# Altium project Mainboard.PrjPcb (part 3 of 3)

## Sheet USB_Connectors.SchDoc
size A3; PageSetup: Record=PageOptions|CenterHorizontal=True|CenterVertical=True|PrintScale=0.71|XCorrection=1.00|YCorrection=1.00|PrintKind=0|BorderSize=5000000|LeftOffset=0|BottomOffset=0|Orientation=2|PaperLength=1000|PaperWidth=1000|Scale=100|PaperSource=7|PrintQuality=-4|MediaType=1|DitherType=10|PaperKind=A4|PrintScaleMode=1; Date: 27.05.2014; DrawnBy: luths8; Organization: BFH; Address1: Bern University of Applied Sciences; Address2: Engineering and Information Technology; Address3: Jlcoweg 1; Address4: CH-3400 Burgdorf; DocumentNumber: 7; Revision: 1.0; SheetNumber: 10; SheetTotal: 19; CurrentDate: 27.05.2014
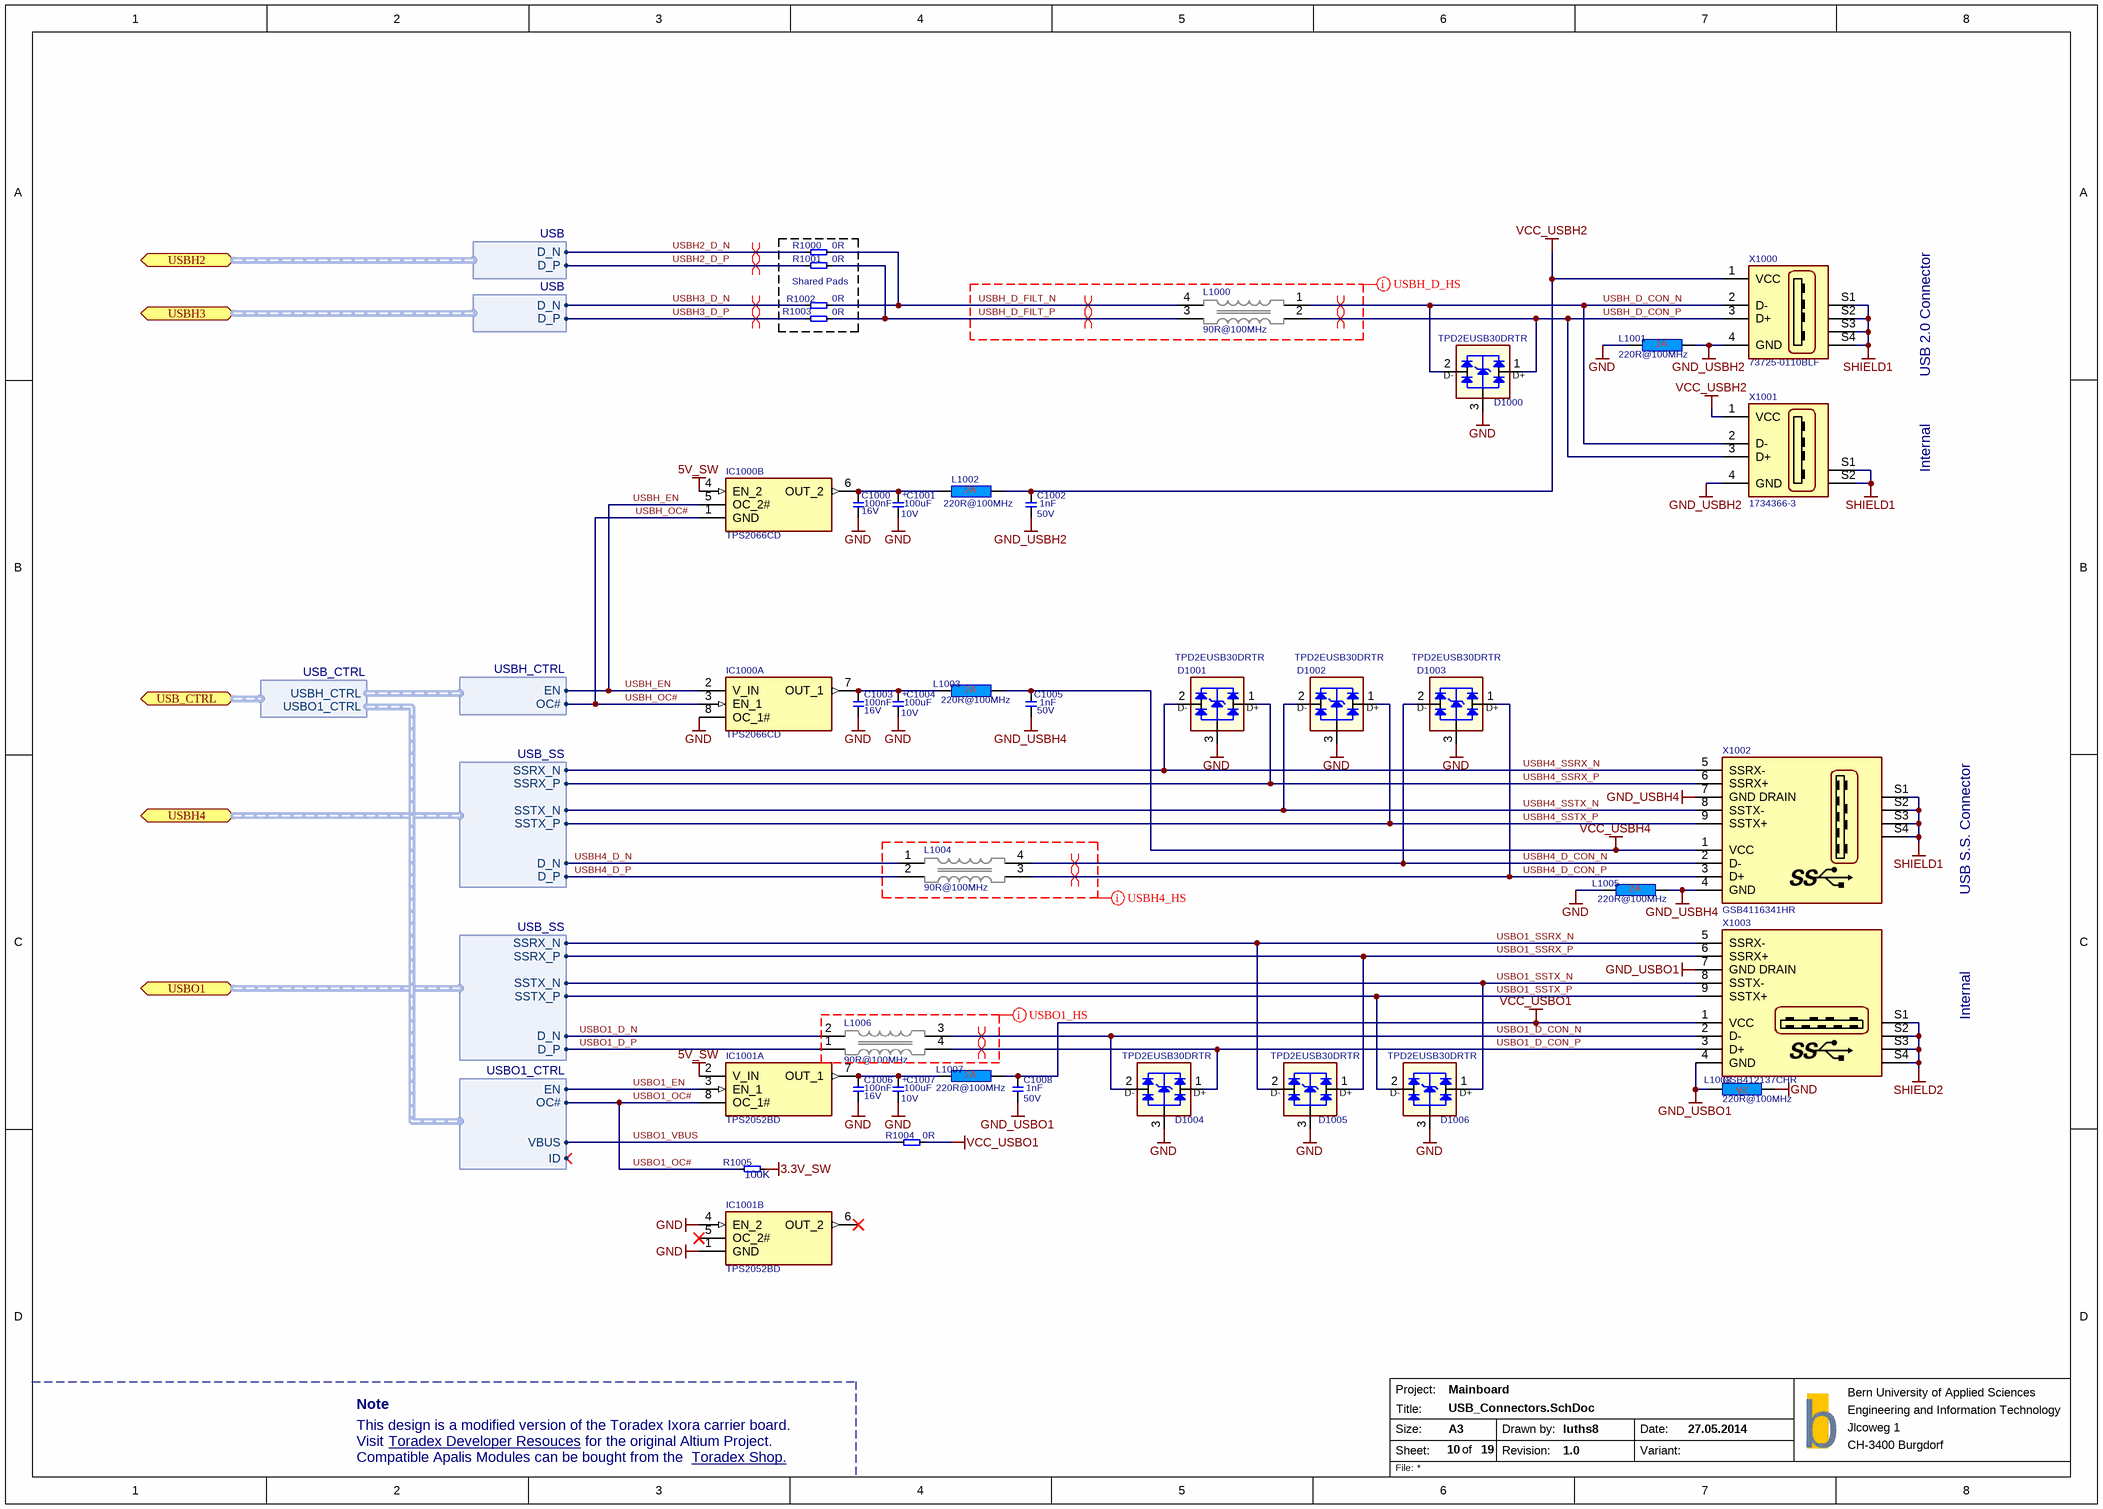
[diagram p14: USB_Connectors.SchDoc]

### Parts
C1000  Rating: 16V  [SMD0603CAP]  (hidden comment: 100nF)
C1001  Rating: 10V  [CAPMP6032X280N]  (hidden comment: 100uF)
C1002  Rating: 50V  [SMD0603CAP]  (hidden comment: 1nF)
C1003  Rating: 16V  [SMD0603CAP]  (hidden comment: 100nF)
C1004  Rating: 10V  [CAPMP6032X280N]  (hidden comment: 100uF)
C1005  Rating: 50V  [SMD0603CAP]  (hidden comment: 1nF)
C1006  Rating: 16V  [SMD0603CAP]  (hidden comment: 100nF)
C1007  Rating: 10V  [CAPMP6032X280N]  (hidden comment: 100uF)
C1008  Rating: 50V  [SMD0603CAP]  (hidden comment: 1nF)
D1000  TPD2EUSB30DRTR  [T_TI_TPD2EUSB30DRTR]
D1001  TPD2EUSB30DRTR  [T_TI_TPD2EUSB30DRTR]
D1002  TPD2EUSB30DRTR  [T_TI_TPD2EUSB30DRTR]
D1003  TPD2EUSB30DRTR  [T_TI_TPD2EUSB30DRTR]
D1004  TPD2EUSB30DRTR  [T_TI_TPD2EUSB30DRTR]
D1005  TPD2EUSB30DRTR  [T_TI_TPD2EUSB30DRTR]
D1006  TPD2EUSB30DRTR  [T_TI_TPD2EUSB30DRTR]
IC1000  TPS2066CD  [SOIC127P600X173-8N]  (parts A,B of 2)
IC1001  TPS2052BD  [SOIC127P600X173-8N]  (parts A,B of 2)
L1000  90R@100MHz  [T_Murata_DLW21SN900SQ2]
L1001  220R@100MHz  [INDC1608X95N]
L1002  220R@100MHz  [INDC1608X95N]
L1003  220R@100MHz  [INDC1608X95N]
L1004  90R@100MHz  [T_Murata_DLW21SN900SQ2]
L1005  220R@100MHz  [INDC1608X95N]
L1006  90R@100MHz  [T_Murata_DLW21SN900SQ2]
L1007  220R@100MHz  [INDC1608X95N]
L1008  220R@100MHz  [INDC1608X95N]
R1000  0R  [SMD0603RES]
R1001  0R  [SMD0603RES]
R1002  0R  [SMD0603RES]
R1003  0R  [SMD0603RES]
R1004  0R  [SMD0603RES]
R1005  100K  [SMD0603RES]
X1000  Manufacturer Part No.: 73725-0110BLF  [T_FCI_73725-0110BLF]  (hidden comment: CON-Fci-73725-0110BLF)
X1001  CON-TE-1734366-3  [1734366-3]  (value not drawn)
X1002  GSB4116341HR  [GSB4116341HR]
X1003  GSB412137CHR  [GSB412137CHR]

### Blocks framed on the sheet
Shared Pads: R1000-R1003

### Ports
USB_CTRL (bidir, harness USB_CTRL), USBH2 (bidir, harness USB), USBH3 (bidir, harness USB), USBH4 (bidir, harness USB_SS), USBO1 (bidir, harness USB_SS)

### Harnesses
USB_SS: D_N, D_P, SSTX_N, SSTX_P, SSRX_N, SSRX_P
USBO1_CTRL: VBUS, ID, OC#, EN
USBH_CTRL: OC#, EN
USB_CTRL: USBO1_CTRL, USBH_CTRL
USB: D_N, D_P

### Nets
3.3V_SW: R1005.2
5V_SW: IC1000.4(EN_2) IC1001.2(V_IN)
GND: C1000.1 C1001.2 C1003.1 C1004.2 C1006.1 C1007.2 D1000.3 D1001.3 D1002.3 D1003.3 D1004.3 D1005.3 D1006.3 IC1000.8(OC_1#) IC1001.1(GND) IC1001.4(EN_2) L1001.1 L1005.1 L1008.1
GND_USBH2: C1002.1 L1001.2 X1000.4(GND) X1001.4(GND)
GND_USBH4: C1005.1 L1005.2 X1002.4(GND) X1002.7(GND_DRAIN)
GND_USBO1: C1008.1 L1008.2 X1003.4(GND) X1003.7(GND_DRAIN)
SHIELD1: X1000.S1 X1000.S2 X1000.S3 X1000.S4 X1001.S1 X1001.S2 X1002.S1 X1002.S2 X1002.S3 X1002.S4
SHIELD2: X1003.S1 X1003.S2 X1003.S3 X1003.S4
VCC_USBH2: C1002.2 L1002.2 X1000.1(VCC) X1001.1(VCC)
VCC_USBH4: C1005.2 L1003.2 X1002.1(VCC)
VCC_USBO1: C1008.2 L1007.2 R1004.2 X1003.1(VCC)
USBH2_D_N: R1000.1 ; port USBH2.D_N
USBH2_D_P: R1001.1 ; port USBH2.D_P
USBH3_D_N: R1002.1 ; port USBH3.D_N
USBH3_D_P: R1003.1 ; port USBH3.D_P
USBH4_D_CON_N: D1003.2(D-) L1004.4 X1002.2(D-)
USBH4_D_CON_P: D1003.1(D+) L1004.3 X1002.3(D+)
USBH4_D_N: L1004.1 ; port USBH4.D_N
USBH4_D_P: L1004.2 ; port USBH4.D_P
USBH4_SSRX_N: D1001.2(D-) X1002.5(SSRX-) ; port USBH4.SSRX_N
USBH4_SSRX_P: D1001.1(D+) X1002.6(SSRX+) ; port USBH4.SSRX_P
USBH4_SSTX_N: D1002.2(D-) X1002.8(SSTX-) ; port USBH4.SSTX_N
USBH4_SSTX_P: D1002.1(D+) X1002.9(SSTX+) ; port USBH4.SSTX_P
USBH_D_CON_N: D1000.2(D-) L1000.1 X1000.2(D-) X1001.2(D-)
USBH_D_CON_P: D1000.1(D+) L1000.2 X1000.3(D+) X1001.3(D+)
USBH_D_FILT_N: L1000.4 R1000.2 R1002.2
USBH_D_FILT_P: L1000.3 R1001.2 R1003.2
USBH_EN: IC1000.2(V_IN) IC1000.5(OC_2#) ; harness USBH_CTRL.EN
USBH_OC#: IC1000.1(GND) IC1000.3(EN_1) ; harness USBH_CTRL.OC#
USBO1_D_CON_N: D1004.2(D-) L1006.3 X1003.2(D-)
USBO1_D_CON_P: D1004.1(D+) L1006.4 X1003.3(D+)
USBO1_D_N: L1006.2 ; port USBO1.D_N
USBO1_D_P: L1006.1 ; port USBO1.D_P
USBO1_EN: IC1001.3(EN_1) ; harness USBO1_CTRL.EN
USBO1_OC#: IC1001.8(OC_1#) R1005.1 ; harness USBO1_CTRL.OC#
USBO1_SSRX_N: D1005.2(D-) X1003.5(SSRX-) ; port USBO1.SSRX_N
USBO1_SSRX_P: D1005.1(D+) X1003.6(SSRX+) ; port USBO1.SSRX_P
USBO1_SSTX_N: D1006.1(D+) X1003.8(SSTX-) ; port USBO1.SSTX_N
USBO1_SSTX_P: D1006.2(D-) X1003.9(SSTX+) ; port USBO1.SSTX_P
USBO1_VBUS: R1004.1 ; harness USBO1_CTRL.VBUS
NetC1000_2: C1000.2 C1001.1 IC1000.6(OUT_2) L1002.1
NetC1003_2: C1003.2 C1004.1 IC1000.7(OUT_1) L1003.1
NetC1006_2: C1006.2 C1007.1 IC1001.7(OUT_1) L1007.1

Not connected (* = marked no-connect by the designer): IC1001 5(OC_2#)* 6(OUT_2)*

### Layout directives
differential pair: USBH2_D_N, USBH2_D_P, USBH3_D_N, USBH3_D_P, USBH4_D_CON_N, USBH4_D_CON_P, USBH_D_CON_N, USBH_D_CON_P, USBH_D_FILT_N, USBH_D_FILT_P, USBO1_D_CON_N, USBO1_D_CON_P
net class USBO1_HS: (no net found under the mark)
net class USBH4_HS: (no net found under the mark)
net class USBH_D_HS: USBH_D_FILT_N, USBH_D_FILT_P

### Notes on the sheet
- USB 2.0 Connector
- Internal
- USB S.S. Connector
- Note
- This design is a modified version of the Toradex Ixora carrier board.
- Visit
- Compatible Apalis Modules can be bought from the
- Toradex Developer Resouces <https://developer.toradex.com/products/ixora-carrier-board>
- for the original Altium Project.
- Toradex Shop. <https://www.toradex.com/order-now/apalis-arm-family>
- Project:
- Size:
- Sheet:
- Title:
- A3
- of
- Drawn by:
- Revision:
- Date:
- Variant:
- b
- File:
- (in symbol C-TA-100uF-10V-10%-6032) +

### Library data of the parts
C1000 C1003 C1006 = C-X7R-100nF-16V-10%-0402: Capacitor Ceramic X7R 100nF 16V 10% 0603; Tolerance: 10%; Type: X7R; Value: 100nF
C1001 C1004 C1007 = C-TA-100uF-10V-10%-6032: Capacitor TA 100uF 10V 10% 6032; Tolerance: 10%; Type: TA; Value: 100uF
C1002 C1005 C1008 = C-X7R-1nF-50V-10%-0402: Capacitor Ceramic X7R 1nF 50V 10% 0603; Tolerance: 10%; Type: X7R; Value: 1nF
D1000-D1006 = D-TI-TPD2EUSB30DRTR: 2 Channel Protection for Super Speed USB3.0; Manufacturer Name: TI; Manufacturer Part No.: TPD2EUSB30DRTR
IC1000 = IC-TI-TPS2066CD: 1A Dual High Side Switch (Current Limiting (Fixed), Over Temperature, Reverse Current, UVLO); Manufacturer Name: Texas Instruments; Manufacturer Part No.: TPS2066CD
IC1001 = IC-TI-TPS2052BD: Dual High Side Switch With OC_DET 500mA/CH; Manufacturer Name: Texas Instruments; Manufacturer Part No.: TPS2052BD
L1000 L1004 L1006 = L-Murata-DLW21SN900SQ2-90R@100MHz-330mA-25%: Common Mode Choke High Speed 90R 330mA; Manufacturer Name: Murata; Tolerance: 25%; Rating: 330mA; Manufacturer Part No.: DLW21SN900SQ2; Value: 90R@100MHz
L1001-L1003 L1005 L1007 L1008 = L-220R@100MHz-2A-25%-0603: 220R@100MHz 2A EMI FILTER; Tolerance: 25%; Rating: 2A; Value: 220R@100MHz
R1000-R1003 = R-0R-63mW-1%-0603: Resistor 0 ohm 63mW 1% 0603; Rating: 63mW; Tolerance: 1%; Value: 0R
R1004 = R-0R-63mW-1%-0402: Resistor 0 ohm 63mW 1% 0603; Rating: 63mW; Tolerance: 1%; Value: 0R
R1005 = R-100KR-63mW-5%-0402: Resistor 100 Kohm 63mW 5% 0603; Value: 100KR; Rating: 63mW; Tolerance: 5%
X1000 = CON-Fci-73725-0110BLF: USB Type A Connector; Manufacturer Name: FCI; No. of ways: 4; System: Connector
X1001 = CON-TE-1734366-3: USB Type A Connector Vertical; Manufacturer Name: TE; Manufacturer Part No.: 1734366-3; System: Connector
X1002 = CON-Amphenol-GSB4116341HR: USB 3.1, Type A, sideways; System: Connector; Manufacturer Name: Amphenol; Manufacturer Part No.: GSB4116341HR
X1003 = CON-Amphenol-GSB412137CHR: USB 3.1, Type A, vertical; System: Connector; Manufacturer Name: Amphenol; Manufacturer Part No.: GSB412137CHR

## Sheet USB.SchDoc
size A3; PageSetup: Record=PageOptions|CenterHorizontal=True|CenterVertical=True|PrintScale=0.73|XCorrection=1.00|YCorrection=1.00|PrintKind=0|BorderSize=5000000|LeftOffset=0|BottomOffset=0|Orientation=2|PaperLength=1000|PaperWidth=1000|Scale=100|PaperSource=7|PrintQuality=-4|MediaType=1|DitherType=10|PaperKind=A4|PrintScaleMode=1; Date: 27.05.2014; DrawnBy: luths8; Organization: BFH; Address1: Bern University of Applied Sciences; Address2: Engineering and Information Technology; Address3: Jlcoweg 1; Address4: CH-3400 Burgdorf; DocumentNumber: 6; Revision: 1.0; SheetNumber: 9; SheetTotal: 19; CurrentDate: 27.05.2014
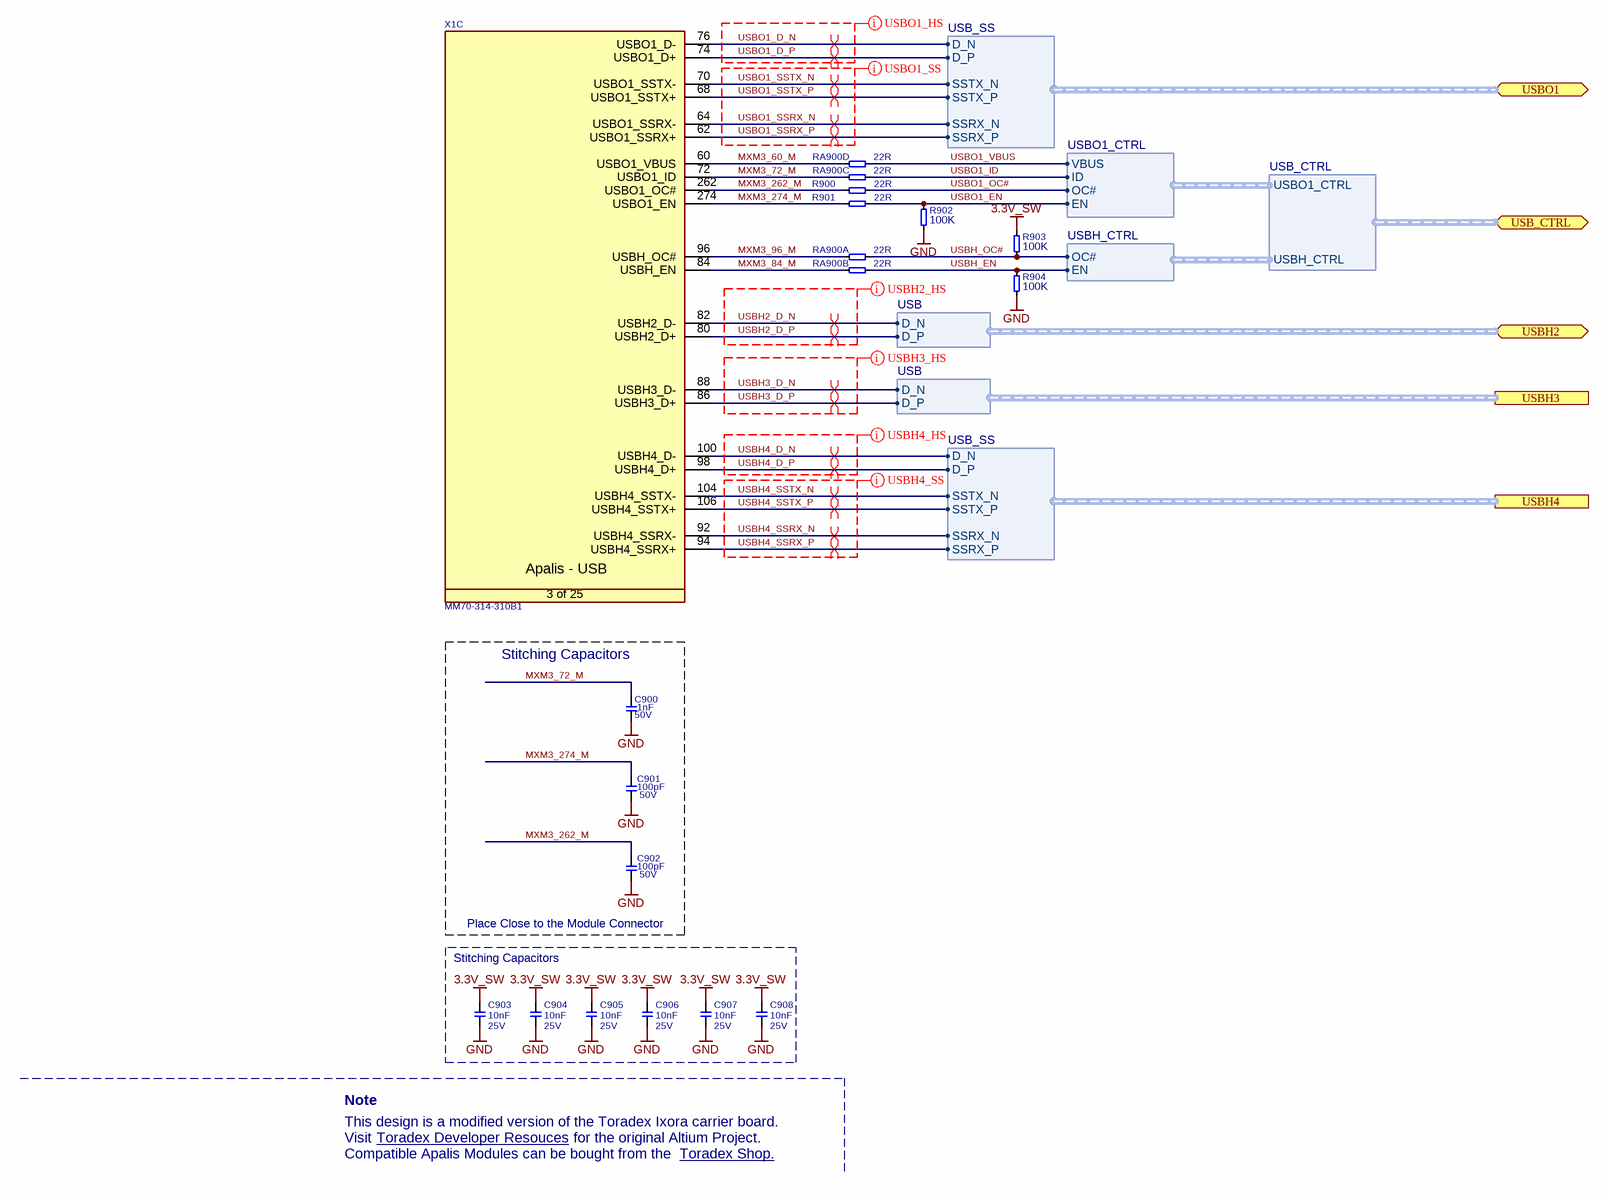
[diagram p15: USB.SchDoc]

### Parts
C900  Rating: 50V  [SMD0603CAP]  (hidden comment: 1nF)
C901  Rating: 50V  [SMD0603CAP]  (hidden comment: 100pF)
C902  Rating: 50V  [SMD0603CAP]  (hidden comment: 100pF)
C903  10nF  Rating: 25V  [SMD0603CAP]
C904  10nF  Rating: 25V  [SMD0603CAP]
C905  10nF  Rating: 25V  [SMD0603CAP]
C906  10nF  Rating: 25V  [SMD0603CAP]
C907  10nF  Rating: 25V  [SMD0603CAP]
C908  10nF  Rating: 25V  [SMD0603CAP]
R900  22R  [SMD0603RES]
R901  22R  [SMD0603RES]
R902  100K  [SMD0603RES]
R903  100K  [SMD0603RES]
R904  100K  [SMD0603RES]
RA900  22R  [T_Resistor_Array_X4]  (parts A,B,C,D of 4)
X1  Manufacturer Part No.: MM70-314-310B1  [T_JAE_MM70-314-310B1]  (hidden comment: CON-JAE-MM70-314-310B1-314-0.5mm)  (part C of 25)

### Blocks framed on the sheet
Stitching Capacitors: C900-C902

### Ports
USB_CTRL (bidir, harness USB_CTRL), USBH2 (bidir, harness USB), USBH3 (harness USB), USBH4 (harness USB_SS), USBO1 (bidir, harness USB_SS)

### Harnesses
USB_SS: D_N, D_P, SSTX_N, SSTX_P, SSRX_N, SSRX_P
USB: D_N, D_P
USBO1_CTRL: VBUS, ID, OC#, EN
USBH_CTRL: OC#, EN
USB_CTRL: USBO1_CTRL, USBH_CTRL

### Nets
3.3V_SW: C903.2 C904.2 C905.2 C906.2 C907.2 C908.2 R903.1
GND: C900.1 C901.1 C902.1 C903.1 C904.1 C905.1 C906.1 C907.1 C908.1 R902.1 R904.1
MXM3_60_M: RA900.1 X1.60(USBO1_VBUS)
MXM3_72_M: C900.2 RA900.2 X1.72(USBO1_ID)
MXM3_84_M: RA900.3 X1.84(USBH_EN)
MXM3_96_M: RA900.4 X1.96(USBH_OC#)
MXM3_262_M: C902.2 R900.1 X1.262(USBO1_OC#)
MXM3_274_M: C901.2 R901.1 X1.274(USBO1_EN)
USBH2_D_N: X1.82(USBH2_D-) ; port USBH2.D_N
USBH2_D_P: X1.80(USBH2_D+) ; port USBH2.D_P
USBH3_D_N: X1.88(USBH3_D-) ; port USBH3.D_N
USBH3_D_P: X1.86(USBH3_D+) ; port USBH3.D_P
USBH4_D_N: X1.100(USBH4_D-) ; port USBH4.D_N
USBH4_D_P: X1.98(USBH4_D+) ; port USBH4.D_P
USBH4_SSRX_N: X1.92(USBH4_SSRX-) ; port USBH4.SSRX_N
USBH4_SSRX_P: X1.94(USBH4_SSRX+) ; port USBH4.SSRX_P
USBH4_SSTX_N: X1.104(USBH4_SSTX-) ; port USBH4.SSTX_N
USBH4_SSTX_P: X1.106(USBH4_SSTX+) ; port USBH4.SSTX_P
USBH_EN: R904.2 RA900.7 ; harness USBH_CTRL.EN
USBH_OC#: R903.2 RA900.8 ; harness USBH_CTRL.OC#
USBO1_D_N: X1.76(USBO1_D-) ; port USBO1.D_N
USBO1_D_P: X1.74(USBO1_D+) ; port USBO1.D_P
USBO1_EN: R901.2 R902.2 ; harness USBO1_CTRL.EN
USBO1_ID: RA900.6 ; harness USBO1_CTRL.ID
USBO1_OC#: R900.2 ; harness USBO1_CTRL.OC#
USBO1_SSRX_N: X1.64(USBO1_SSRX-) ; port USBO1.SSRX_N
USBO1_SSRX_P: X1.62(USBO1_SSRX+) ; port USBO1.SSRX_P
USBO1_SSTX_N: X1.70(USBO1_SSTX-) ; port USBO1.SSTX_N
USBO1_SSTX_P: X1.68(USBO1_SSTX+) ; port USBO1.SSTX_P
USBO1_VBUS: RA900.5 ; harness USBO1_CTRL.VBUS

### Layout directives
differential pair: USBH2_D_N, USBH2_D_P, USBH3_D_N, USBH3_D_P, USBH4_D_N, USBH4_D_P, USBH4_SSRX_N, USBH4_SSRX_P, USBH4_SSTX_N, USBH4_SSTX_P, USBO1_D_N, USBO1_D_P, USBO1_SSRX_N, USBO1_SSRX_P, USBO1_SSTX_N, USBO1_SSTX_P
net class USBO1_SS: USBO1_SSRX_N, USBO1_SSRX_P, USBO1_SSTX_N, USBO1_SSTX_P
net class USBO1_HS: USBO1_D_N, USBO1_D_P
net class USBH2_HS: USBH2_D_N, USBH2_D_P
net class USBH3_HS: USBH3_D_N, USBH3_D_P
net class USBH4_SS: USBH4_SSRX_N, USBH4_SSRX_P, USBH4_SSTX_N, USBH4_SSTX_P
net class USBH4_HS: USBH4_D_N, USBH4_D_P

### Notes on the sheet
- (near C902) Place Close to the Module Connector
- Stitching Capacitors
- Note
- This design is a modified version of the Toradex Ixora carrier board.
- Visit
- Compatible Apalis Modules can be bought from the
- Toradex Developer Resouces <https://developer.toradex.com/products/ixora-carrier-board>
- for the original Altium Project.
- Toradex Shop. <https://www.toradex.com/order-now/apalis-arm-family>
- Project:
- Size:
- Sheet:
- Title:
- A3
- of
- Drawn by:
- Revision:
- Date:
- Variant:
- b
- File:
- (in symbol CON-JAE-MM70-314-310B1-314-0.5mm, part C) Apalis - USB; 3 of 25

### Library data of the parts
C900 = C-X7R-1nF-50V-10%-0402: Capacitor Ceramic X7R 1nF 50V 10% 0603; Tolerance: 10%; Type: X7R; Value: 1nF
C901 C902 = C-X7R-100pF-50V-10%-0402: Capacitor Ceramic X7R 100pF 50V 10% 0603; Tolerance: 10%; Type: X7R; Value: 100pF
C903-C908 = C-X7R-10nF-25V-10%-0603: Capacitor Ceramic X7R 10nF 25V 10% 0603; Tolerance: 10%; Type: X7R; Value: 10nF
R900 R901 = R-22R-63mW-5%-0402: Resistor 22 ohm 63mW 5% 0603; Rating: 63mW; Tolerance: 5%; Value: 22R
R902-R904 = R-100KR-63mW-5%-0402: as R1005 on sheet USB_Connectors; Rating: 63mW; Tolerance: 5%
RA900 = RA-22R-63mW-5%-1206-div: Resistor Array 22 R 63mW 5% 1206; Tolerance: 5%; Power Dissipation: 63mW; Value: 22R
X1 = CON-JAE-MM70-314-310B1-314-0.5mm: as X1 on sheet Power_Switch

## Sheet HDMI.SchDoc
size A3; PageSetup: Record=PageOptions|CenterHorizontal=True|CenterVertical=True|PrintScale=0.73|XCorrection=1.00|YCorrection=1.00|PrintKind=0|BorderSize=5000000|LeftOffset=0|BottomOffset=0|Orientation=2|PaperLength=1000|PaperWidth=1000|Scale=100|PaperSource=7|PrintQuality=-4|MediaType=1|DitherType=10|PaperKind=A4|PrintScaleMode=1; Date: 27.05.2014; DrawnBy: luths8; Organization: BFH; Address1: Bern University of Applied Sciences; Address2: Engineering and Information Technology; Address3: Jlcoweg 1; Address4: CH-3400 Burgdorf; DocumentNumber: 1; Revision: 1.0; SheetNumber: 14; SheetTotal: 19; CurrentDate: 27.05.2014
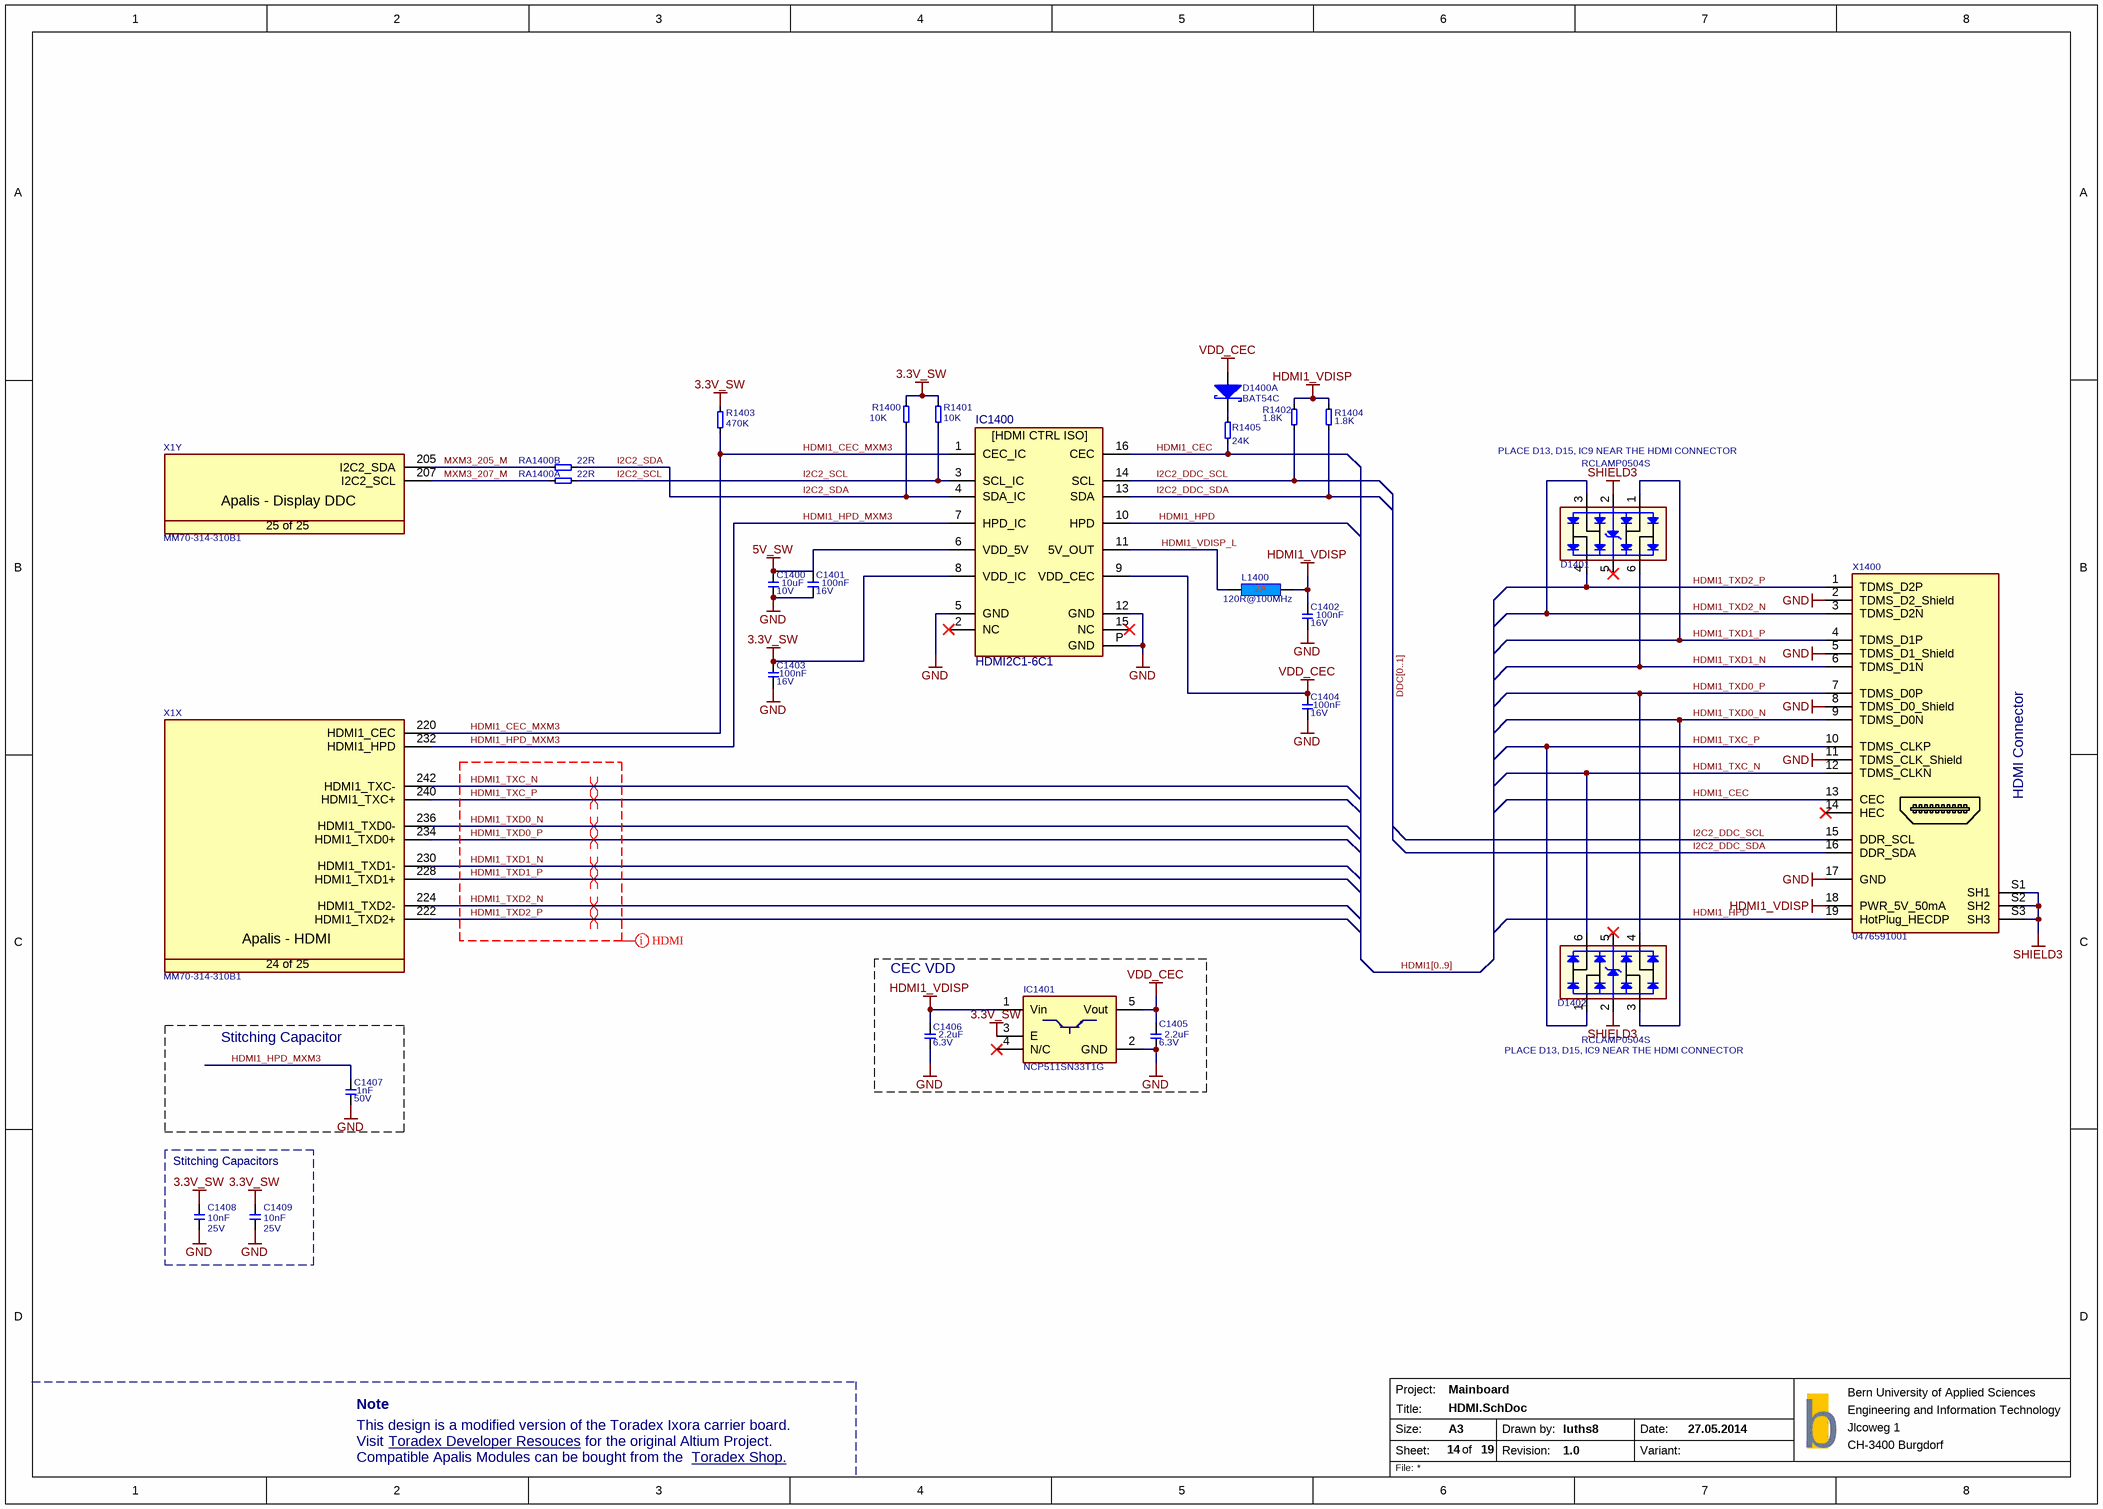
[diagram p16: HDMI.SchDoc]

### Parts
C1400  Rating: 10V  [SMD0603CAP]  (hidden comment: 10uF)
C1401  Rating: 16V  [SMD0603CAP]  (hidden comment: 100nF)
C1402  Rating: 16V  [SMD0603CAP]  (hidden comment: 100nF)
C1403  Rating: 16V  [SMD0603CAP]  (hidden comment: 100nF)
C1404  Rating: 16V  [SMD0603CAP]  (hidden comment: 100nF)
C1405  Rating: 6.3V  [SMD0603CAP]  (hidden comment: 2.2uF)
C1406  Rating: 6.3V  [SMD0603CAP]  (hidden comment: 2.2uF)
C1407  Rating: 50V  [SMD0603CAP]  (hidden comment: 1nF)
C1408  10nF  Rating: 25V  [SMD0603CAP]
C1409  10nF  Rating: 25V  [SMD0603CAP]
D1400  BAT54C  [SOT95P230X110-3N]  (part A of 2)
D1401  RCLAMP0504S  [T_SOT95P285X90-6N]
D1402  RCLAMP0504S  [T_SOT95P285X90-6N]
IC1400  HDMI2C1-6C1  [DFN16]
IC1401  NCP511SN33T1G  [SOT95P279X142-5N]
L1400  120R@100MHz  [INDC1608X95N]
R1400  10K  [SMD0603RES]
R1401  10K  [SMD0603RES]
R1402  1.8K  [SMD0603RES]
R1403  470K  [SMD0603RES]
R1404  1.8K  [SMD0603RES]
R1405  24K  [SMD0603RES]
RA1400  22R  [T_Resistor_Array_X4]  (parts A,B of 4)
X1  Manufacturer Part No.: MM70-314-310B1  [T_JAE_MM70-314-310B1]  (hidden comment: CON-JAE-MM70-314-310B1-314-0.5mm)  (parts X,Y of 25)
X1400  0476591001  [0476591001]

### Blocks framed on the sheet
CEC VDD: C1405 C1406 IC1401
Stitching Capacitor: C1407
Stitching Capacitors: C1408 C1409

### Nets
3.3V_SW: C1403.2 C1408.2 C1409.2 IC1400.8(VDD_IC) IC1401.3(E) R1400.2 R1401.2 R1403.2
5V_SW: C1400.2 C1401.1 IC1400.6(VDD_5V)
GND: C1400.1 C1401.2 C1402.1 C1403.1 C1404.1 C1405.1 C1406.1 C1407.1 C1408.1 C1409.1 IC1400.5(GND) IC1400.12(GND) IC1400.P(GND) IC1401.2(GND) X1400.2(TDMS_D2_Shield) X1400.5(TDMS_D1_Shield) X1400.8(TDMS_D0_Shield) X1400.11(TDMS_CLK_Shield) X1400.17(GND)
HDMI1_VDISP: C1402.2 C1406.2 IC1401.1(Vin) L1400.2 R1402.2 R1404.2 X1400.18(PWR_5V_50mA)
SHIELD3: D1401.2 D1402.2 X1400.S1(SH1) X1400.S2(SH2) X1400.S3(SH3)
VDD_CEC: C1404.2 C1405.2 D1400.1 IC1400.9(VDD_CEC) IC1401.5(Vout)
HDMI1_CEC: IC1400.16(CEC) R1405.1 X1400.13(CEC)
HDMI1_CEC_MXM3: IC1400.1(CEC_IC) R1403.1 X1.220(HDMI1_CEC)
HDMI1_HPD: IC1400.10(HPD) X1400.19(HotPlug_HECDP)
HDMI1_HPD_MXM3: C1407.2 IC1400.7(HPD_IC) X1.232(HDMI1_HPD)
HDMI1_TXC_N: D1402.6 X1.242(HDMI1_TXC-) X1400.12(TDMS_CLKN)
HDMI1_TXC_P: D1402.1 X1.240(HDMI1_TXC+) X1400.10(TDMS_CLKP)
HDMI1_TXD0_N: D1402.3 X1.236(HDMI1_TXD0-) X1400.9(TDMS_D0N)
HDMI1_TXD0_P: D1402.4 X1.234(HDMI1_TXD0+) X1400.7(TDMS_D0P)
HDMI1_TXD1_N: D1401.6 X1.230(HDMI1_TXD1-) X1400.6(TDMS_D1N)
HDMI1_TXD1_P: D1401.1 X1.228(HDMI1_TXD1+) X1400.4(TDMS_D1P)
HDMI1_TXD2_N: D1401.3 X1.224(HDMI1_TXD2-) X1400.3(TDMS_D2N)
HDMI1_TXD2_P: D1401.4 X1.222(HDMI1_TXD2+) X1400.1(TDMS_D2P)
HDMI1_VDISP_L: IC1400.11(5V_OUT) L1400.1
I2C2_DDC_SCL: IC1400.14(SCL) R1402.1 X1400.15(DDR_SCL)
I2C2_DDC_SDA: IC1400.13(SDA) R1404.1 X1400.16(DDR_SDA)
I2C2_SCL: IC1400.3(SCL_IC) R1401.1 RA1400.5
I2C2_SDA: IC1400.4(SDA_IC) R1400.1 RA1400.6
MXM3_205_M: RA1400.2 X1.205(I2C2_SDA)
MXM3_207_M: RA1400.1 X1.207(I2C2_SCL)
NetD1400_3: D1400.3 R1405.2

Not connected (* = marked no-connect by the designer): D1401 5*; D1402 5*; IC1400 2(NC)* 15(NC)*; IC1401 4(N/C)*; X1400 14(HEC)*

### Buses and harness runs
bus DDC[0..1]
bus HDMI1[0..9]

### Layout directives
differential pair: HDMI1_TXC_N, HDMI1_TXC_P, HDMI1_TXD0_N, HDMI1_TXD0_P, HDMI1_TXD1_N, HDMI1_TXD1_P, HDMI1_TXD2_N, HDMI1_TXD2_P
net class HDMI: HDMI1_TXC_N, HDMI1_TXC_P, HDMI1_TXD0_N, HDMI1_TXD0_P, HDMI1_TXD1_N, HDMI1_TXD1_P, HDMI1_TXD2_N, HDMI1_TXD2_P

### Notes on the sheet
- (near D1401) PLACE D13, D15, IC9 NEAR THE HDMI CONNECTOR
- (near X1400) HDMI Connector
- (near D1402) PLACE D13, D15, IC9 NEAR THE HDMI CONNECTOR
- Note
- This design is a modified version of the Toradex Ixora carrier board.
- Visit
- Compatible Apalis Modules can be bought from the
- Toradex Developer Resouces <https://developer.toradex.com/products/ixora-carrier-board>
- for the original Altium Project.
- Toradex Shop. <https://www.toradex.com/order-now/apalis-arm-family>
- Project:
- Size:
- Sheet:
- Title:
- A3
- of
- Drawn by:
- Revision:
- Date:
- Variant:
- b
- File:
- (in symbol CON-JAE-MM70-314-310B1-314-0.5mm, part X) Apalis - HDMI; 24 of 25
- (in symbol CON-JAE-MM70-314-310B1-314-0.5mm, part Y) Apalis - Display DDC; 25 of 25
- (in symbol HDMI2C1-6C1) [HDMI CTRL ISO]

### Library data of the parts
C1400 = C-X5R-10uF-10V-20%-0603: Capacitor Ceramic X5R 10uF 10V 20% 0603; Tolerance: 20%; Type: X5R; Value: 10uF
C1401-C1404 = C-X7R-100nF-16V-10%-0402: Capacitor Ceramic X7R 100nF 16V 10% 0603; Tolerance: 10%; Type: X7R; Value: 100nF
C1405 C1406 = C-X5R-2.2uF-6.3V-20%-0603: Capacitor Ceramic X5R 2.2uF 6.3V 20% 0603; Tolerance: 20%; Type: X5R; Value: 2.2uF
C1407 = C-X7R-1nF-50V-10%-0402: Capacitor Ceramic X7R 1nF 50V 10% 0603; Tolerance: 10%; Type: X7R; Value: 1nF
C1408 C1409 = C-X7R-10nF-25V-10%-0603: Capacitor Ceramic X7R 10nF 25V 10% 0603; Tolerance: 10%; Type: X7R; Value: 10nF
D1400 = D-Philips-BAT54C-Schottky-30V-200mA: BAT54 Schottky Diode; Manufacturer: Philips; Manufacturer Part Number: BAT54C
D1401 D1402 = D-Semtech-RClamp0504S: TVS Array low cap; Manufacturer Name: Semtech; Manufacturer Part No.: RCLAMP0504S
IC1400 = HDMI2C1-6C1: HDMI ESD protection, level shifter and backdrive protection; Manufacturer Name: STMicroelectronics
IC1401 = IC-ON-NCP511SN33T1G: NCP511SN33T1G LDO Regulator; Manufacturer Name: ON Semiconductor; Manufacturer Part No.: NCP511SN33T1G
L1400 = L-120R@100MHz-2A-25%-0603: 120R@100MHz 2A EMI FILTER; Tolerance: 25%; Rating: 2A; Value: 120R@100MHz
R1400 R1401 = R-10KR-63mW-1%-0603: Resistor 10 Kohm 63mW 1% 0603; Value: 10KR; Rating: 63mW; Tolerance: 1%
R1402 R1404 = R-1.8KR-63mW-5%-0603: Resistor 1.8 Kohm 63mW 5% 0603; Value: 1.8KR; Rating: 63mW; Tolerance: 5%
R1403 = R-470KR-63mW-5%-0402: Resistor 470 Kohm 63mW 5% 0603; Value: 470KR; Rating: 63mW; Tolerance: 5%
R1405 = R-24KR-63mW-1%-0402: Resistor 24 Kohm 63mW 1% 0603; Value: 24KR; Rating: 63mW; Tolerance: 1%
RA1400 = RA-22R-63mW-5%-1206-div: Resistor Array 22 R 63mW 5% 1206; Tolerance: 5%; Power Dissipation: 63mW; Value: 22R
X1 = CON-JAE-MM70-314-310B1-314-0.5mm: MXM3 Connector; Manufacturer Name: JAE; No. of ways: 314
X1400 = CON-Molex-0476591001: HDMI Connector Vertical; Manufacturer: Molex; Manufacturer Part No.: 0476591001; System: Connector

## Sheet Miscellaneous.SchDoc
size A3; PageSetup: Record=PageOptions|CenterHorizontal=True|CenterVertical=True|PrintScale=0.71|XCorrection=1.00|YCorrection=1.00|PrintKind=0|BorderSize=5000000|LeftOffset=0|BottomOffset=0|Orientation=2|PaperLength=1000|PaperWidth=1000|Scale=100|PaperSource=7|PrintQuality=-4|MediaType=1|DitherType=10|PaperKind=A4|PrintScaleMode=1; Date: 27.05.2014; DrawnBy: luths8; Organization: BFH; Address1: Bern University of Applied Sciences; Address2: Engineering and Information Technology; Address3: Jlcoweg 1; Address4: CH-3400 Burgdorf; DocumentNumber: 1; Revision: 1.0; CurrentDate: 27.05.2014
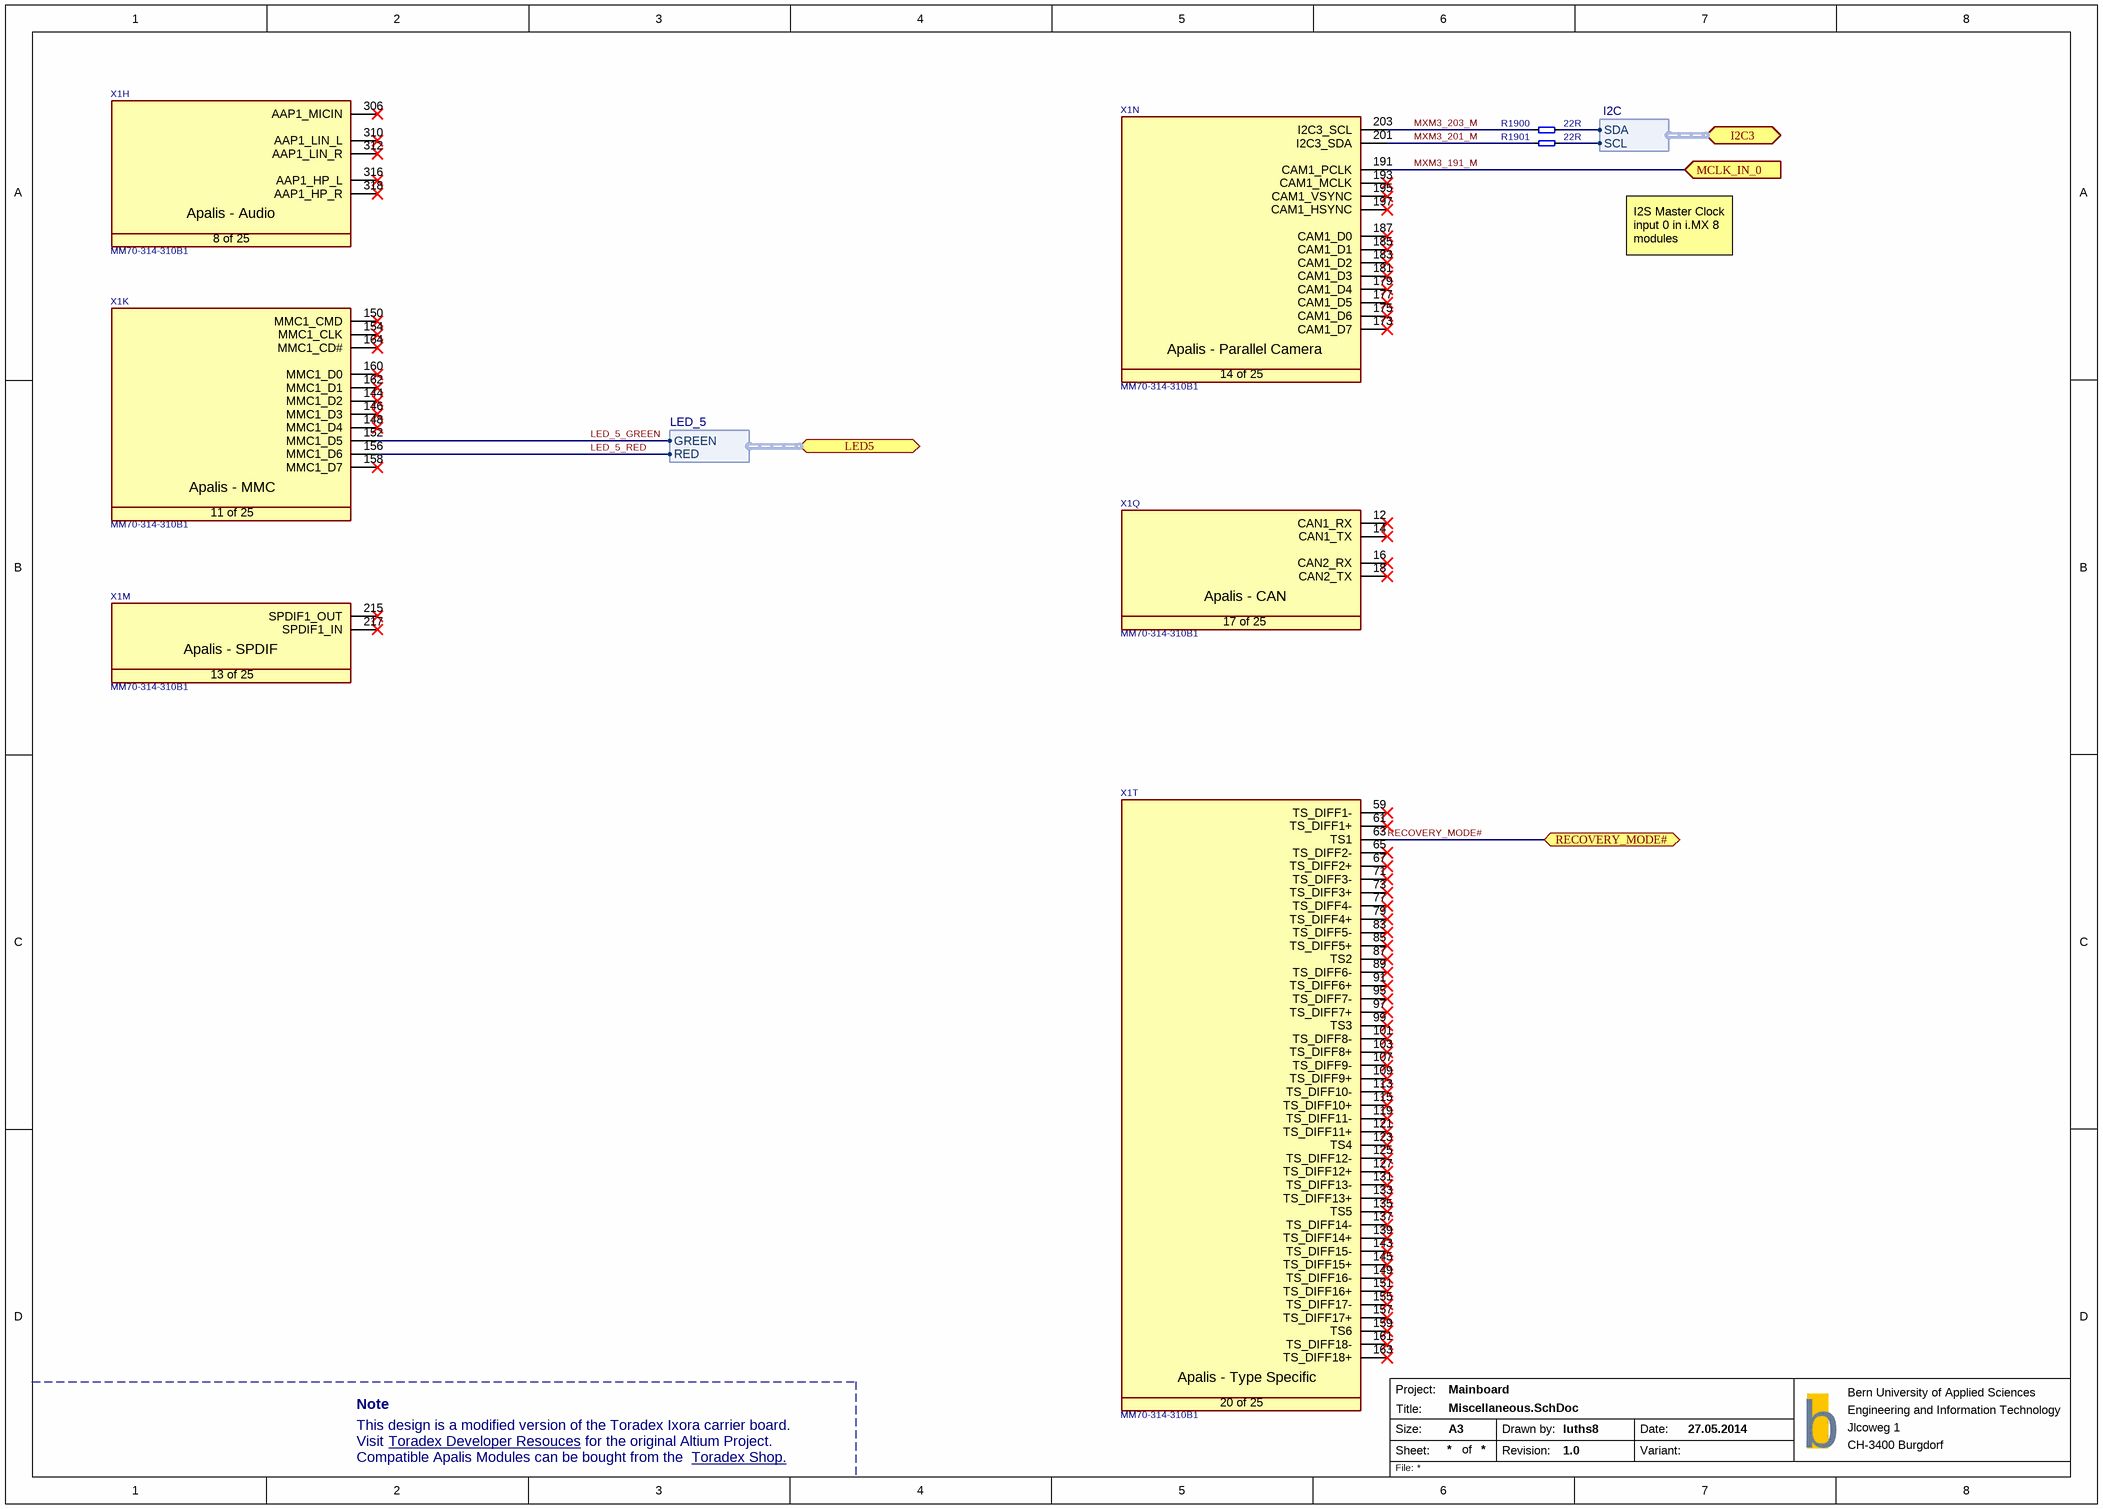
[diagram p17: Miscellaneous.SchDoc]

### Parts
R1900  22R  [SMD0603RES]
R1901  22R  [SMD0603RES]
X1  Manufacturer Part No.: MM70-314-310B1  [T_JAE_MM70-314-310B1]  (hidden comment: CON-JAE-MM70-314-310B1-314-0.5mm)  (parts H,K,M,N,Q,T of 25)

### Ports
I2C3 (bidir, harness I2C, see 12, 17, 19, 5), LED5 (bidir, harness LED_5, see 19), MCLK_IN_0 (in), RECOVERY_MODE# (bidir, see 19)

### Harnesses
LED_5: GREEN, RED
I2C: SCL, SDA

### Nets
LED_5_GREEN: X1.152(MMC1_D5) ; port LED5.GREEN
LED_5_RED: X1.156(MMC1_D6) ; port LED5.RED
MXM3_191_M: X1.191(CAM1_PCLK) ; port MCLK_IN_0
MXM3_201_M: R1901.1 X1.201(I2C3_SDA)
MXM3_203_M: R1900.1 X1.203(I2C3_SCL)
RECOVERY_MODE#: X1.63(TS1) ; port RECOVERY_MODE#
NetR1203_2: R1900.2 ; port I2C3.SDA
NetR1204_2: R1901.2 ; port I2C3.SCL

Not connected (* = marked no-connect by the designer): X1 12(CAN1_RX)* 14(CAN1_TX)* 16(CAN2_RX)* 18(CAN2_TX)* 59(TS_DIFF1-)* 61(TS_DIFF1+)* 65(TS_DIFF2-)* 67(TS_DIFF2+)* 71(TS_DIFF3-)* 73(TS_DIFF3+)* 77(TS_DIFF4-)* 79(TS_DIFF4+)* 83(TS_DIFF5-)* 85(TS_DIFF5+)* 87(TS2)* 89(TS_DIFF6-)* 91(TS_DIFF6+)* 95(TS_DIFF7-)* 97(TS_DIFF7+)* 99(TS3)* 101(TS_DIFF8-)* 103(TS_DIFF8+)* 107(TS_DIFF9-)* 109(TS_DIFF9+)* 113(TS_DIFF10-)* 115(TS_DIFF10+)* 119(TS_DIFF11-)* 121(TS_DIFF11+)* 123(TS4)* 125(TS_DIFF12-)* 127(TS_DIFF12+)* 131(TS_DIFF13-)* 133(TS_DIFF13+)* 135(TS5)* 137(TS_DIFF14-)* 139(TS_DIFF14+)* 143(TS_DIFF15-)* 144(MMC1_D2)* 145(TS_DIFF15+)* 146(MMC1_D3)* 148(MMC1_D4)* 149(TS_DIFF16-)* 150(MMC1_CMD)* 151(TS_DIFF16+)* 154(MMC1_CLK)* 155(TS_DIFF17-)* 157(TS_DIFF17+)* 158(MMC1_D7)* 159(TS6)* 160(MMC1_D0)* 161(TS_DIFF18-)* 162(MMC1_D1)* 163(TS_DIFF18+)* 164(MMC1_CD#)* 173(CAM1_D7)* 175(CAM1_D6)* 177(CAM1_D5)* 179(CAM1_D4)* 181(CAM1_D3)* 183(CAM1_D2)* 185(CAM1_D1)* 187(CAM1_D0)* 193(CAM1_MCLK)* 195(CAM1_VSYNC)* 197(CAM1_HSYNC)* 215(SPDIF1_OUT)* 217(SPDIF1_IN)* 306(AAP1_MICIN)* 310(AAP1_LIN_L)* 312(AAP1_LIN_R)* 316(AAP1_HP_L)* 318(AAP1_HP_R)*

### Notes on the sheet
- I2S Master Clock input 0 in i.MX 8 modules
- Note
- This design is a modified version of the Toradex Ixora carrier board.
- Visit
- Compatible Apalis Modules can be bought from the
- Toradex Developer Resouces <https://developer.toradex.com/products/ixora-carrier-board>
- for the original Altium Project.
- Toradex Shop. <https://www.toradex.com/order-now/apalis-arm-family>
- Project:
- Size:
- Sheet:
- Title:
- A3
- of
- Drawn by:
- Revision:
- Date:
- Variant:
- b
- File:
- (in symbol CON-JAE-MM70-314-310B1-314-0.5mm, part H) Apalis - Audio; 8 of 25
- (in symbol CON-JAE-MM70-314-310B1-314-0.5mm, part K) Apalis - MMC; 11 of 25
- (in symbol CON-JAE-MM70-314-310B1-314-0.5mm, part M) Apalis - SPDIF; 13 of 25
- (in symbol CON-JAE-MM70-314-310B1-314-0.5mm, part N) Apalis - Parallel Camera; 14 of 25
- (in symbol CON-JAE-MM70-314-310B1-314-0.5mm, part Q) Apalis - CAN; 17 of 25
- (in symbol CON-JAE-MM70-314-310B1-314-0.5mm, part T) Apalis - Type Specific; 20 of 25

### Library data of the parts
R1900 R1901 = R-22R-63mW-5%-0402: Resistor 22 ohm 63mW 5% 0603; Rating: 63mW; Tolerance: 5%; Value: 22R
X1 = CON-JAE-MM70-314-310B1-314-0.5mm: as X1 on sheet HDMI

## Sheet Audio.SchDoc
size A3; Date: 27.05.2014; DrawnBy: luths8; Organization: BFH; Address1: Bern University of Applied Sciences; Address2: Engineering and Information Technology; Address3: Jlcoweg 1; Address4: CH-3400 Burgdorf; DocumentNumber: 1; Revision: 1.0; SheetNumber: 12; SheetTotal: 19; CurrentDate: 27.05.2014
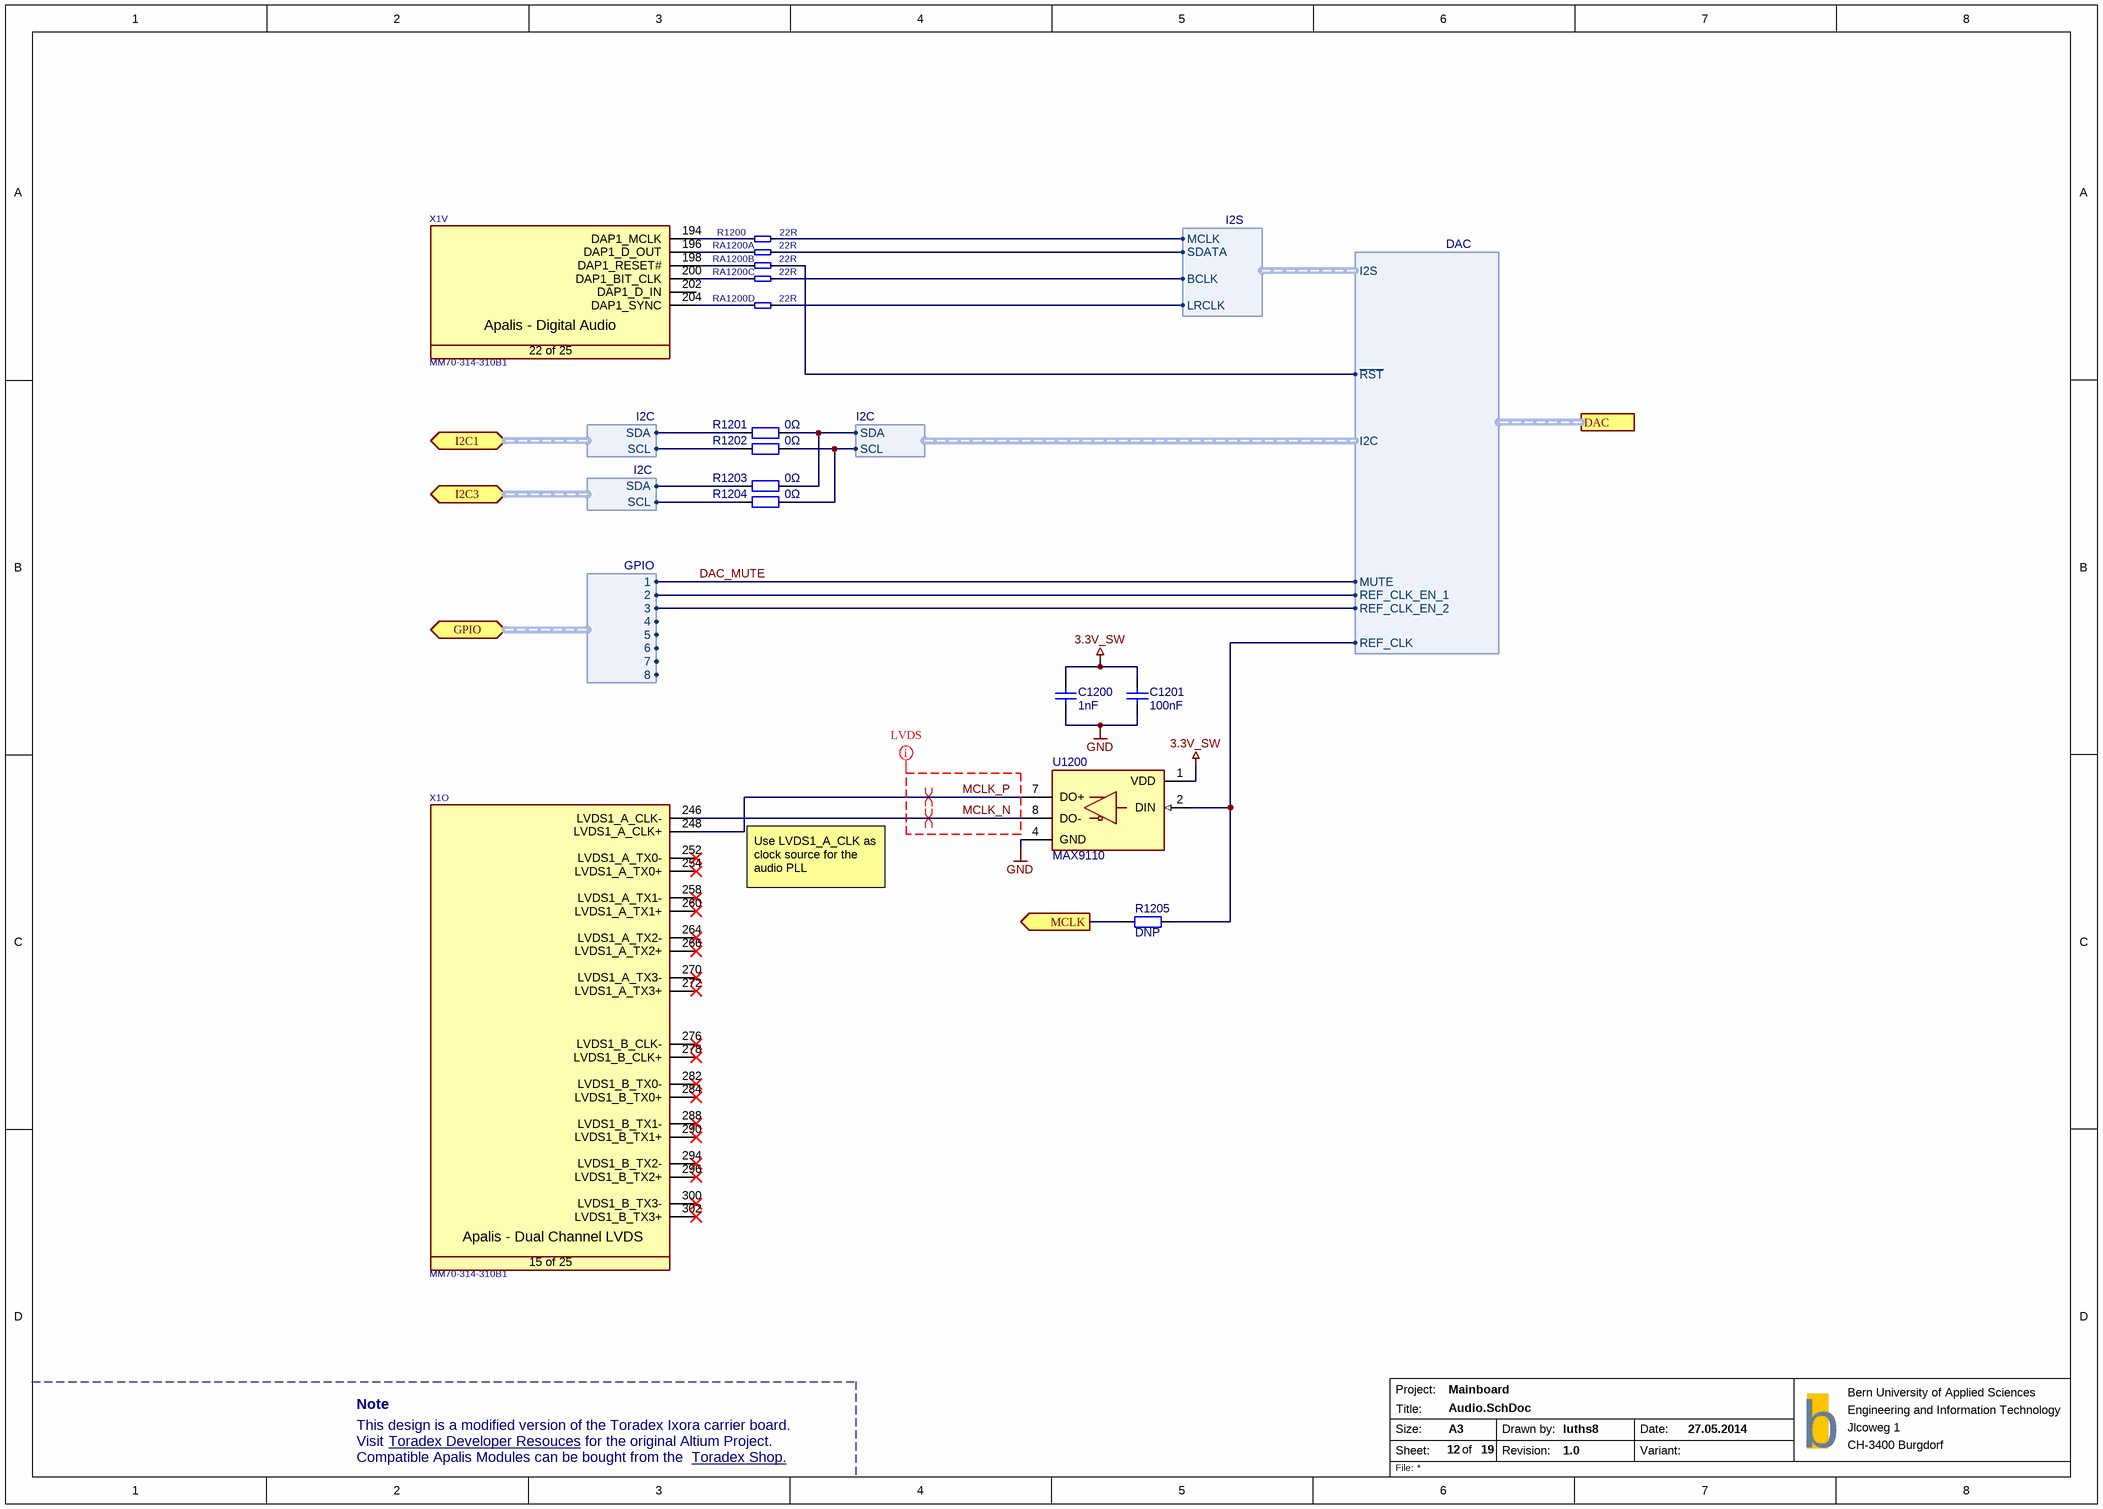
[diagram p18: Audio.SchDoc]

### Parts
C1200  1nF  [SMD0603CAP]
C1201  100nF  [SMD0603CAP]
R1200  22R  [SMD0603RES]
R1201  0Ω  [SMD0603RES]
R1202  0Ω  [SMD0603RES]
R1203  0Ω  [SMD0603RES]
R1204  0Ω  [SMD0603RES]
R1205  DNP  [SMD0603RES]
RA1200  22R  [T_Resistor_Array_X4]  (parts A,B,C,D of 4)
U1200  MAX9110  [SOIC8]
X1  Manufacturer Part No.: MM70-314-310B1  [T_JAE_MM70-314-310B1]  (hidden comment: CON-JAE-MM70-314-310B1-314-0.5mm)  (parts O,V of 25)

### Ports
DAC (harness DAC), GPIO (bidir, harness GPIO, see 12, 17, 19, 5), I2C1 (bidir, harness I2C, see 12, 17, 19, 5), I2C3 (bidir, harness I2C, see 12, 17, 19, 5), MCLK (out)

### Harnesses
I2S: MCLK, BCLK, LRCLK, SDATA
DAC: I2S, ~{RST}, I2C, MUTE, REF_CLK_EN_1, REF_CLK_EN_2, REF_CLK
I2C: SCL, SDA
GPIO: 1, 2, 3, 4, 5, 6, 7, 8

### Nets
3.3V_SW: C1200.1 C1201.1 U1200.1(VDD)
GND: C1200.2(q) C1201.2(q) U1200.4(GND)
DAC_MUTE: port DAC.MUTE, port GPIO.1
I2C1_SCL: R1202.2 ; port I2C1.SCL
I2C1_SDA: R1201.2 ; port I2C1.SDA
MCLK_N: U1200.8(DO-) X1.246(LVDS1_A_CLK-)
MCLK_P: U1200.7(DO+) X1.248(LVDS1_A_CLK+)
MXM3_191_M: R1205.2 ; port MCLK
NetR1200_1: R1200.1 X1.194(DAP1_MCLK)
NetR1200_2: R1200.2 ; harness I2S.MCLK
NetR1201_1: R1201.1 R1203.1 ; harness I2C.SDA
NetR1202_1: R1202.1 R1204.1 ; harness I2C.SCL
NetR1203_2: R1203.2 ; port I2C3.SDA
NetR1204_2: R1204.2 ; port I2C3.SCL
NetR1205_1: R1205.1 U1200.2(DIN) ; port DAC.REF_CLK
NetRA1200_1: RA1200.1 X1.196(DAP1_D_OUT)
NetRA1200_2: RA1200.2 X1.198(DAP1_RESET#)
NetRA1200_3: RA1200.3 X1.200(DAP1_BIT_CLK)
NetRA1200_4: RA1200.4 X1.204(DAP1_SYNC)
NetRA1200_5: RA1200.5 ; harness I2S.SDATA
NetRA1200_6: RA1200.6 ; port DAC.~{RST}
NetRA1200_7: RA1200.7 ; harness I2S.BCLK
NetRA1200_8: RA1200.8 ; harness I2S.LRCLK
NetRA1802_6: port DAC.REF_CLK_EN_2, port GPIO.3
NetRA1802_7: port DAC.REF_CLK_EN_1, port GPIO.2

Not connected (* = marked no-connect by the designer): X1 202(DAP1_D_IN) 252(LVDS1_A_TX0-)* 254(LVDS1_A_TX0+)* 258(LVDS1_A_TX1-)* 260(LVDS1_A_TX1+)* 264(LVDS1_A_TX2-)* 266(LVDS1_A_TX2+)* 270(LVDS1_A_TX3-)* 272(LVDS1_A_TX3+)* 276(LVDS1_B_CLK-)* 278(LVDS1_B_CLK+)* 282(LVDS1_B_TX0-)* 284(LVDS1_B_TX0+)* 288(LVDS1_B_TX1-)* 290(LVDS1_B_TX1+)* 294(LVDS1_B_TX2-)* 296(LVDS1_B_TX2+)* 300(LVDS1_B_TX3-)* 302(LVDS1_B_TX3+)*

### Layout directives
differential pair: MCLK_N, MCLK_P
net class LVDS: MCLK_N, MCLK_P

### Notes on the sheet
- Use LVDS1_A_CLK as clock source for the audio PLL
- Note
- This design is a modified version of the Toradex Ixora carrier board.
- Visit
- Compatible Apalis Modules can be bought from the
- Toradex Developer Resouces <https://developer.toradex.com/products/ixora-carrier-board>
- for the original Altium Project.
- Toradex Shop. <https://www.toradex.com/order-now/apalis-arm-family>
- Project:
- Size:
- Sheet:
- Title:
- A3
- of
- Drawn by:
- Revision:
- Date:
- Variant:
- b
- File:
- (in symbol CON-JAE-MM70-314-310B1-314-0.5mm, part H) Apalis - Audio; 8 of 25
- (in symbol CON-JAE-MM70-314-310B1-314-0.5mm, part M) Apalis - SPDIF; 13 of 25
- (in symbol CON-JAE-MM70-314-310B1-314-0.5mm, part V) Apalis - Digital Audio; 22 of 25
- (in symbol CON-JAE-MM70-314-310B1-314-0.5mm, part O) Apalis - Dual Channel LVDS; 15 of 25

### Library data of the parts
C1200 C1201 = Capacitor Ceramic: Ceramic Capacitor; Voltage: *; Manufacturer Part No.: *
R1200 = R-22R-63mW-5%-0402: Resistor 22 ohm 63mW 5% 0603; Rating: 63mW; Tolerance: 5%; Value: 22R
R1201-R1205 = Resistor: Manufacturer Part No.: *
RA1200 = RA-22R-63mW-5%-1206-div: Resistor Array 22 R 63mW 5% 1206; Tolerance: 5%; Power Dissipation: 63mW; Value: 22R
U1200 = MAX9110: LVDS Transmitter; Manufacturer Part No.: MAX9110ESA+
X1 = CON-JAE-MM70-314-310B1-314-0.5mm: as X1 on sheet HDMI

## Nets that join several sheets
3.3V: Power_Supply (16 pins), Power_Switch (17 pins), Extension (R1801.1)
3.3V_SW: Digital Isolator (8 pins), Ethernet (C1100.2 C1101.2 D1100.A D1101.A), PCI_Express (C1700.2 C1701.2 C1702.2 L1700.1), Power_Supply (R600.1), Power_Switch (5 pins), RGB_Display (7 pins), RTC (R800.2 R803.2 R804.2 R805.2), Sata (7 pins), Serial (8 pins), Extension (6 pins), USB_Connectors (R1005.2), USB (7 pins), HDMI (8 pins), Audio (C1200.1 C1201.1 U1200.1)
5V_SW: Power_Switch (9 pins), USB_Connectors (IC1000.4 IC1001.2), HDMI (C1400.2 C1401.1 IC1400.6)
+15V: Audio Power Supply (13 pins), Digital Isolator (Q400.4 R406.2)
A+3.3V: 1 (C310_1.P C311_1.2 U301_1.44), 2 (C310_2.P C311_2.2 U301_2.44), Audio Power Supply (7 pins)
A+5V: 1 (11 pins), 2 (11 pins), Audio Power Supply (7 pins)
A+12V: 1 (6 pins), 2 (6 pins), Audio Power Supply (9 pins)
A-12V: 1 (6 pins), 2 (6 pins), Audio Power Supply (7 pins)
AGND: 1 (48 pins), 2 (48 pins), Audio Power Supply (74 pins), Digital Isolator (20 pins)
AGND2: Power_Supply (X1.303 X1.304 X1.308 X1.313), Power_Switch (C729.1 IC704.2 L702.1)
AVCC: Power_Supply (X1.314 X1.320), Power_Switch (C729.2 IC704.5)
CHGND: 1 (J300_1.0), 2 (J300_2.0), Audio Power Supply (R205.2)
D+3.3V: 1 (7 pins), 2 (7 pins), Audio Power Supply (8 pins), Digital Isolator (14 pins)
GND: Digital Isolator (13 pins), Ethernet (C1100.1 C1101.1 C1102.2 C1103.1), PCI_Express (16 pins), Power_Supply (60 pins), Power_Switch (48 pins), RGB_Display (17 pins), RTC (7 pins), Sata (23 pins), Serial (9 pins), Extension (11 pins), USB_Connectors (19 pins), USB (11 pins), HDMI (19 pins), Audio (C1200.2 C1201.2 U1200.4)
SHIELD1: Power_Supply (L602.2), USB_Connectors (10 pins)
SHIELD2: Power_Supply (L603.2), USB_Connectors (X1003.S1 X1003.S2 X1003.S3 X1003.S4)
SHIELD3: Power_Supply (L604.2), HDMI (5 pins)
SHIELD4: Ethernet (X1100.P1 X1100.S1 X1100.S2), Power_Supply (L605.2)
V_SUPPLY_FILT: Power_Supply (C601.2 C602.2 C603.2 L600.2), Power_Switch (12 pins)
VCC_INTRTC: Power_Supply (C610.2 X1.174), RTC (R801.2)
~{A_RST}: 1 (U301_1.2), 2 (U301_2.2), Digital Isolator (TP408.1 U400.11)
A_BCLK: 1 (R305_1.2), 2 (R305_2.2), Digital Isolator (TP403.1 U400.14)
A_LRCLK: 1 (R306_1.2), 2 (R306_2.2), Digital Isolator (TP405.1 U400.13)
A_SCL: 1 (R313_1.2), 2 (R313_2.2), Digital Isolator (R402.1 TP410.1 U401.12)
A_SDA: 1 (R315_1.2), 2 (R315_2.2), Digital Isolator (R401.1 TP412.1 U401.11)
A_SDATA: 1 (R307_1.2), 2 (R307_2.2), Digital Isolator (TP407.1 U400.12)
DAC_MUTE: Digital Isolator (U402.5), Extension (RA1802.8)
I2C1_SCL: PCI_Express (R1707.1), RGB_Display (X1301.3), RTC (IC800.6 R804.1 RA800.7), Audio (R1202.2)
I2C1_SDA: PCI_Express (R1706.1), RGB_Display (X1301.4), RTC (IC800.5 R803.1 RA800.8), Audio (R1201.2)
LED_5_GREEN: Extension (R1810.1 T1802.2), Miscellaneous (X1.152)
LED_5_RED: Extension (R1811.1 T1802.5), Miscellaneous (X1.156)
MUTE: 1 (6 pins), 2 (6 pins), Digital Isolator (C410.1 R407.1)
MXM3_191_M: Miscellaneous (X1.191), Audio (R1205.2)
NetQ400_5: Audio Power Supply (TP208.1 U200.1), Digital Isolator (Q400.5 Q400.6 R406.1)
NetR304_1_2: 1 (R304_1.2), 2 (R304_2.2), Digital Isolator (R400.1 R403.1)
NetR1200_2: Digital Isolator (TP400.1 U400.2), Audio (R1200.2)
NetR1201_1: Digital Isolator (TP411.1 U401.6), Audio (R1201.1 R1203.1)
NetR1202_1: Digital Isolator (TP409.1 U401.5), Audio (R1202.1 R1204.1)
NetR1203_2: Miscellaneous (R1900.2), Audio (R1203.2)
NetR1204_2: Miscellaneous (R1901.2), Audio (R1204.2)
NetR1205_1: Digital Isolator (U403.10), Audio (R1205.1 U1200.2)
NetRA1200_5: Digital Isolator (TP406.1 U400.5), Audio (RA1200.5)
NetRA1200_6: Digital Isolator (U400.6), Audio (RA1200.6)
NetRA1200_7: Digital Isolator (TP402.1 U400.3), Audio (RA1200.7)
NetRA1200_8: Digital Isolator (TP404.1 U400.4), Audio (RA1200.8)
NetRA1800_5: Digital Isolator (U402.2), Extension (RA1800.5)
NetRA1800_6: Digital Isolator (U402.3), Extension (RA1800.6)
NetRA1800_7: Digital Isolator (U402.4), Extension (RA1800.7)
NetRA1800_8: Digital Isolator (U403.15), Extension (RA1800.8)
NetRA1801_5: Digital Isolator (U403.11), Extension (RA1801.5)
NetRA1801_6: Digital Isolator (U403.12), Extension (RA1801.6)
NetRA1801_7: Digital Isolator (U403.13), Extension (RA1801.7)
NetRA1801_8: Digital Isolator (U403.14), Extension (RA1801.8)
NetRA1802_6: Digital Isolator (U402.7), Extension (RA1802.6)
NetRA1802_7: Digital Isolator (U402.6), Extension (RA1802.7)
PCIE1_WDISABLE#_R: PCI_Express (R1703.2), Extension (X1.176)
PS_A12V_EN: Audio Power Supply (VR200.4 VR201.3), Digital Isolator (U402.13)
PS_A+3.3V_EN: Audio Power Supply (VR203.4), Digital Isolator (U402.12)
PS_A+3.3V_PG: Audio Power Supply (R223.1 VR203.5), Digital Isolator (U403.5)
PS_A+5V_EN: Audio Power Supply (VR202.4), Digital Isolator (U402.11)
PS_A+5V_PG: Audio Power Supply (R217.1 VR202.5), Digital Isolator (U403.4)
PS_A+12V_PG: Audio Power Supply (R204.1 VR200.5), Digital Isolator (U403.2)
PS_A-12V_PG: Audio Power Supply (R210.1 VR201.5), Digital Isolator (U403.3)
PS_D+3.3V_PG: Audio Power Supply (U201.2), Digital Isolator (U403.6)
RECOVERY_MODE#: Extension (R1802.2), Miscellaneous (X1.63)
RESET_MOCI#: PCI_Express (X1700.52), Power_Switch (IC703.1 RA700.7), RGB_Display (T1300.1)
TOUCH_INT#: RGB_Display (X1301.5), Extension (RA1803.8)
TOUCH_RESET#: RGB_Display (X1301.6), Extension (RA1803.7)
USBH2_D_N: PCI_Express (R1708.1), USB_Connectors (R1000.1), USB (X1.82)
USBH2_D_P: PCI_Express (R1709.1), USB_Connectors (R1001.1), USB (X1.80)
USBH3_D_N: PCI_Express (R1710.1), USB_Connectors (R1002.1), USB (X1.88)
USBH3_D_P: PCI_Express (R1711.1), USB_Connectors (R1003.1), USB (X1.86)
USBH4_D_N: USB_Connectors (L1004.1), USB (X1.100)
USBH4_D_P: USB_Connectors (L1004.2), USB (X1.98)
USBH4_SSRX_N: USB_Connectors (D1001.2 X1002.5), USB (X1.92)
USBH4_SSRX_P: USB_Connectors (D1001.1 X1002.6), USB (X1.94)
USBH4_SSTX_N: USB_Connectors (D1002.2 X1002.8), USB (X1.104)
USBH4_SSTX_P: USB_Connectors (D1002.1 X1002.9), USB (X1.106)
USBH_EN: USB_Connectors (IC1000.2 IC1000.5), USB (R904.2 RA900.7)
USBH_OC#: USB_Connectors (IC1000.1 IC1000.3), USB (R903.2 RA900.8)
USBO1_D_N: USB_Connectors (L1006.2), USB (X1.76)
USBO1_D_P: USB_Connectors (L1006.1), USB (X1.74)
USBO1_EN: USB_Connectors (IC1001.3), USB (R901.2 R902.2)
USBO1_OC#: USB_Connectors (IC1001.8 R1005.1), USB (R900.2)
USBO1_SSRX_N: USB_Connectors (D1005.2 X1003.5), USB (X1.64)
USBO1_SSRX_P: USB_Connectors (D1005.1 X1003.6), USB (X1.62)
USBO1_SSTX_N: USB_Connectors (D1006.1 X1003.8), USB (X1.70)
USBO1_SSTX_P: USB_Connectors (D1006.2 X1003.9), USB (X1.68)
USBO1_VBUS: USB_Connectors (R1004.1), USB (RA900.5)
WAKE1_MICO#: PCI_Express (R1705.1), Power_Switch (R724.1 R725.2)

## Assembly variants
Complete: not fitted C201 C202 C203 C205 C209 C212 C214 C215 C216 C218 C222 C223 C224 C226 C229 C230 C231 C233 C410 C713 C720 C721 C800 C801 MP200 MP202 R203 R205 R209 R211 R212 R216 R218 R222 R314_A R316_B R317_A R317_B R322_A R322_B R323_A R323_B R343_A R343_B R344_A R344_B R403 R710 R723 R801 R1000 R1001 R1203 R1204 R1205 R1302 R1710 R1711 R1802 T1300 X1001